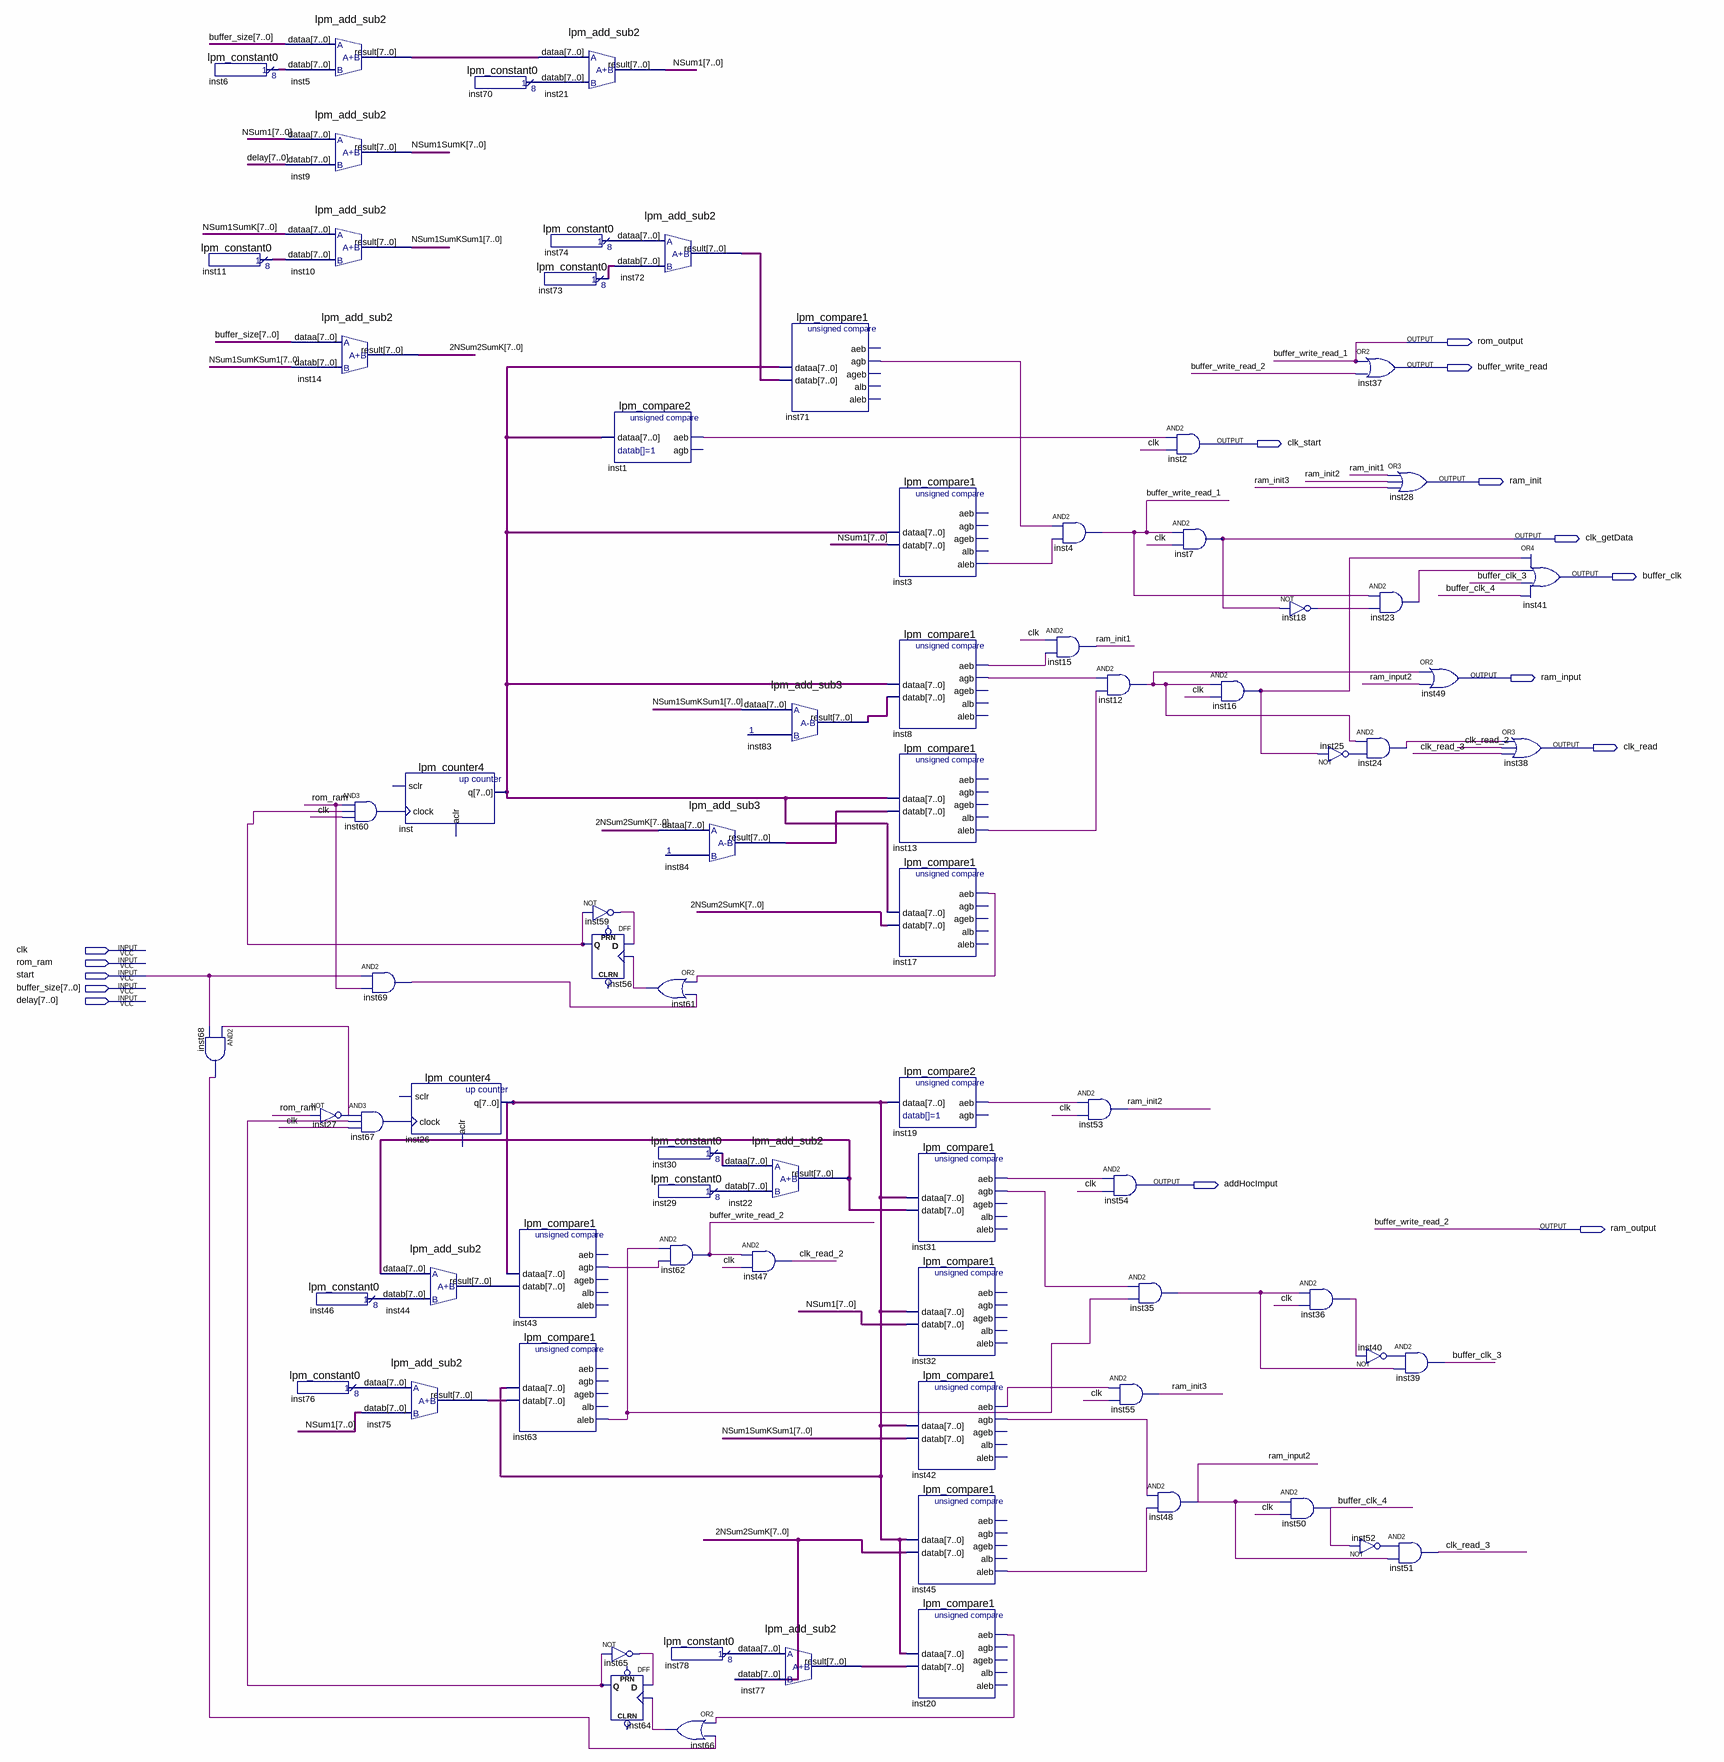
[diagram p0: schematic sheet]
// Quartus schematic ClkOutputs.bdf as structural Verilog: 77 symbols, 15 pins
module ClkOutputs (
  input  clk,
  input  rom_ram,
  input  start,
  input  [7:0] buffer_size,
  input  [7:0] delay,
  output rom_output,
  output buffer_write_read,
  output clk_start,
  output ram_init,
  output clk_getData,
  output buffer_clk,
  output ram_input,
  output clk_read,
  output addHocImput,
  output ram_output
);

  wire buffer_clk_3, buffer_clk_4, clk_read_2, clk_read_3, inst1_aeb, inst3_aleb, inst8_aeb, inst8_agb,
       inst12_out, inst13_aleb, inst16_out, inst17_aeb, inst18_out, inst19_aeb, inst20_aeb, inst23_out,
       inst24_out, inst25_out, inst27_out, inst31_aeb, inst31_agb, inst35_out, inst36_out, inst40_out,
       inst42_aeb, inst42_agb, inst43_agb, inst45_aleb, inst52_out, inst56_q, inst59_out, inst60_out,
       inst61_out, inst63_aleb, inst64_q, inst65_out, inst66_out, inst67_out, inst68_out, inst69_out,
       inst71_agb, ram_init1, ram_init2, ram_init3, ram_input2;
  wire [7:0] \2NSum2SumK , inst5_result, inst6_result, inst11_result, inst22_result, inst26_q, inst29_result,
       inst30_result, inst44_result, inst46_result, inst70_result, inst72_result, inst73_result,
       inst74_result, inst75_result, inst76_result, inst77_result, inst78_result, inst83_result,
       inst84_result, inst_q, NSum1, NSum1SumK, NSum1SumKSum1;

  lpm_constant0 inst6 (.result(inst6_result));
  lpm_constant0 inst11 (.result(inst11_result));
  and inst68 (inst68_out, inst27_out, start);
  lpm_add_sub2 inst5 (.dataa(buffer_size), .datab(inst6_result), .result(inst5_result));
  lpm_add_sub2 inst9 (.dataa(NSum1), .datab(delay), .result(NSum1SumK));
  lpm_add_sub2 inst10 (.dataa(NSum1SumK), .datab(inst11_result), .result(NSum1SumKSum1));
  lpm_add_sub2 inst14 (.dataa(buffer_size), .datab(NSum1SumKSum1), .result(\2NSum2SumK ));
  not inst27 (inst27_out, rom_ram);
  lpm_constant0 inst46 (.result(inst46_result));
  lpm_constant0 inst76 (.result(inst76_result));
  and inst60 (inst60_out, rom_ram, inst56_q, clk);
  and inst69 (inst69_out, start, rom_ram);
  and inst67 (inst67_out, inst27_out, inst64_q, clk);
  lpm_add_sub2 inst75 (.dataa(inst76_result), .datab(NSum1), .result(inst75_result));
  lpm_counter4 inst (.clock(inst60_out), .q(inst_q));  // open: sclr, aclr
  lpm_counter4 inst26 (.clock(inst67_out), .q(inst26_q));  // open: sclr, aclr
  lpm_add_sub2 inst44 (.dataa(inst22_result), .datab(inst46_result), .result(inst44_result));
  lpm_constant0 inst70 (.result(inst70_result));
  lpm_compare1 inst43 (.dataa(inst26_q), .datab(inst44_result), .agb(inst43_agb));  // open: aeb, ageb, alb, aleb
  lpm_compare1 inst63 (.dataa(inst26_q), .datab(inst75_result), .aleb(inst63_aleb));  // open: aeb, agb, ageb, alb
  lpm_add_sub2 inst21 (.dataa(inst5_result), .datab(inst70_result), .result(NSum1));
  lpm_constant0 inst74 (.result(inst74_result));
  lpm_constant0 inst73 (.result(inst73_result));
  lpm_add_sub2 inst72 (.dataa(inst74_result), .datab(inst73_result), .result(inst72_result));
  lpm_compare2 inst1 (.dataa(inst_q), .aeb(inst1_aeb));  // open: agb
  not inst59 (inst59_out, inst56_q);
  DFF inst56 (.CLK(inst61_out), .D(inst59_out), .Q(inst56_q));  // open: CLRN, PRN
  not inst65 (inst65_out, inst64_q);
  DFF inst64 (.CLK(inst66_out), .D(inst65_out), .Q(inst64_q));  // open: CLRN, PRN
  lpm_add_sub3 inst84 (.dataa(\2NSum2SumK ), .result(inst84_result));
  or inst61 (inst61_out, inst17_aeb, inst69_out);
  lpm_constant0 inst30 (.result(inst30_result));
  lpm_constant0 inst29 (.result(inst29_result));
  and inst62 (ram_output, inst63_aleb, inst43_agb);
  lpm_constant0 inst78 (.result(inst78_result));
  or inst66 (inst66_out, inst20_aeb, inst68_out);
  lpm_add_sub2 inst22 (.dataa(inst30_result), .datab(inst29_result), .result(inst22_result));
  lpm_compare1 inst71 (.dataa(inst_q), .datab(inst72_result), .agb(inst71_agb));  // open: aeb, ageb, alb, aleb
  lpm_add_sub3 inst83 (.dataa(NSum1SumKSum1), .result(inst83_result));
  and inst47 (clk_read_2, ram_output, clk);
  lpm_add_sub2 inst77 (.dataa(inst78_result), .datab(\2NSum2SumK ), .result(inst77_result));
  lpm_compare1 inst3 (.dataa(inst_q), .datab(NSum1), .aleb(inst3_aleb));  // open: aeb, agb, ageb, alb
  lpm_compare1 inst8 (
    .dataa(inst_q), .datab(inst83_result), .aeb(inst8_aeb), .agb(inst8_agb));  // open: ageb, alb, aleb
  lpm_compare1 inst13 (.dataa(inst_q), .datab(inst84_result), .aleb(inst13_aleb));  // open: aeb, agb, ageb, alb
  lpm_compare1 inst17 (.dataa(inst_q), .datab(\2NSum2SumK ), .aeb(inst17_aeb));  // open: agb, ageb, alb, aleb
  lpm_compare2 inst19 (.dataa(inst26_q), .aeb(inst19_aeb));  // open: agb
  lpm_compare1 inst31 (
    .dataa(inst26_q), .datab(inst22_result), .aeb(inst31_aeb), .agb(inst31_agb));  // open: ageb, alb, aleb
  lpm_compare1 inst32 (.dataa(inst26_q), .datab(NSum1));  // open: aeb, agb, ageb, alb, aleb
  lpm_compare1 inst42 (
    .dataa(inst26_q), .datab(NSum1SumKSum1), .aeb(inst42_aeb), .agb(inst42_agb));  // open: ageb, alb, aleb
  lpm_compare1 inst45 (.dataa(inst26_q), .datab(\2NSum2SumK ), .aleb(inst45_aleb));  // open: aeb, agb, ageb, alb
  lpm_compare1 inst20 (.dataa(inst26_q), .datab(inst77_result), .aeb(inst20_aeb));  // open: agb, ageb, alb, aleb
  and inst4 (rom_output, inst71_agb, inst3_aleb);
  and inst15 (ram_init1, clk, inst8_aeb);
  and inst53 (ram_init2, inst19_aeb, clk);
  and inst12 (inst12_out, inst8_agb, inst13_aleb);
  and inst54 (addHocImput, inst31_aeb, clk);
  and inst35 (inst35_out, inst31_agb, inst63_aleb);
  and inst55 (ram_init3, inst42_aeb, clk);
  and inst2 (clk_start, inst1_aeb, clk);
  and inst7 (clk_getData, rom_output, clk);
  and inst48 (ram_input2, inst42_agb, inst45_aleb);
  and inst16 (inst16_out, inst12_out, clk);
  not inst18 (inst18_out, clk_getData);
  and inst50 (buffer_clk_4, ram_input2, clk);
  not inst25 (inst25_out, inst16_out);
  and inst36 (inst36_out, inst35_out, clk);
  or inst37 (buffer_write_read, rom_output, ram_output);
  or inst28 (ram_init, ram_init1, ram_init2, ram_init3);
  and inst23 (inst23_out, rom_output, inst18_out);
  and inst24 (inst24_out, inst12_out, inst25_out);
  not inst40 (inst40_out, inst36_out);
  and inst51 (clk_read_3, inst52_out, ram_input2);
  not inst52 (inst52_out, buffer_clk_4);
  or inst49 (ram_input, inst12_out, ram_input2);
  and inst39 (buffer_clk_3, inst40_out, inst35_out);
  or inst41 (buffer_clk, inst16_out, inst23_out, buffer_clk_3, buffer_clk_4);
  or inst38 (clk_read, inst24_out, clk_read_2, clk_read_3);

  // Other names for the same wires on the sheet: buffer_write_read_1 = rom_output; buffer_write_read_2 = ram_output
endmodule
